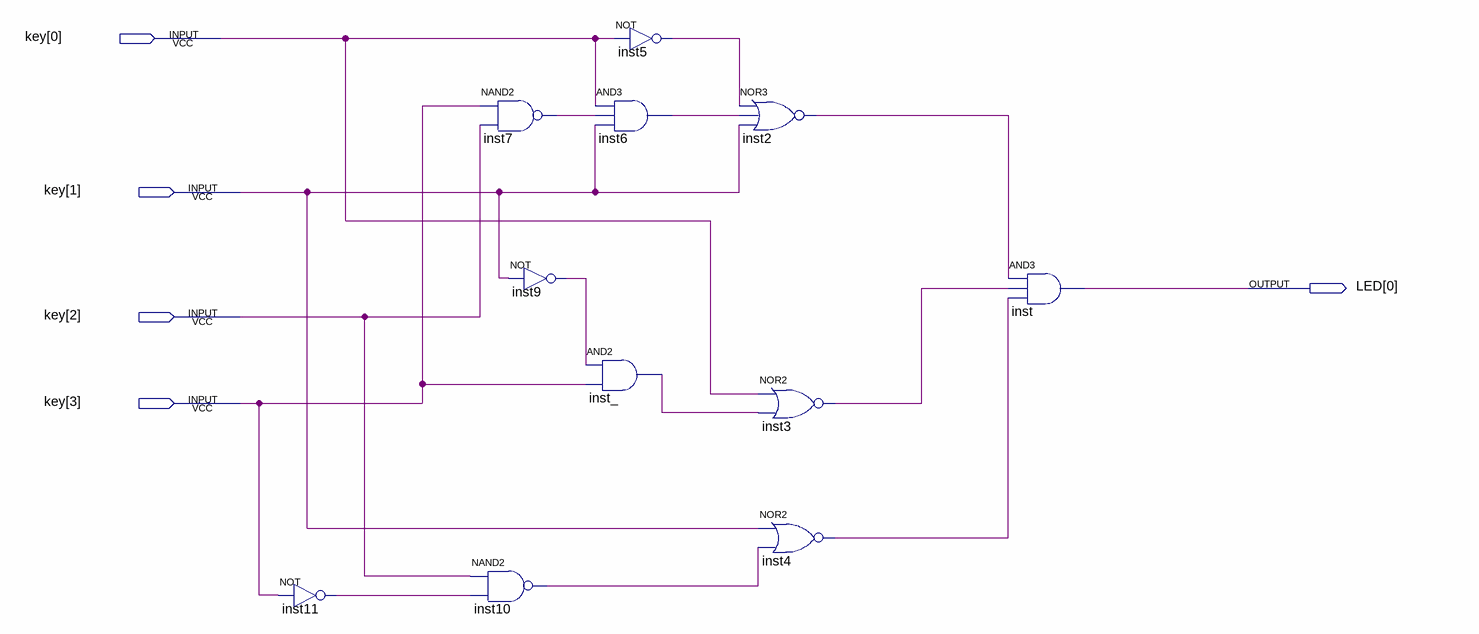
[diagram p0: schematic sheet]
// Quartus schematic lab1.bdf as structural Verilog: 11 symbols, 5 pins
module lab1 (
  input  [3:0] key,
  output [0:0] LED
);

  wire inst2_out, inst3_out, inst4_out, inst5_out, inst6_out, inst7_out, inst9_out, inst10_out, inst11_out,
       inst__out;

  not inst11 (inst11_out, key[3]);
  nand inst7 (inst7_out, key[3], key[2]);
  nand inst10 (inst10_out, key[2], inst11_out);
  not inst9 (inst9_out, key[1]);
  not inst5 (inst5_out, key[0]);
  and inst6 (inst6_out, key[0], inst7_out, key[1]);
  and inst_ (inst__out, inst9_out, key[3]);
  nor inst2 (inst2_out, inst5_out, inst6_out, key[1]);
  nor inst3 (inst3_out, key[0], inst__out);
  nor inst4 (inst4_out, key[1], inst10_out);
  and inst (LED[0], inst2_out, inst3_out, inst4_out);
endmodule
